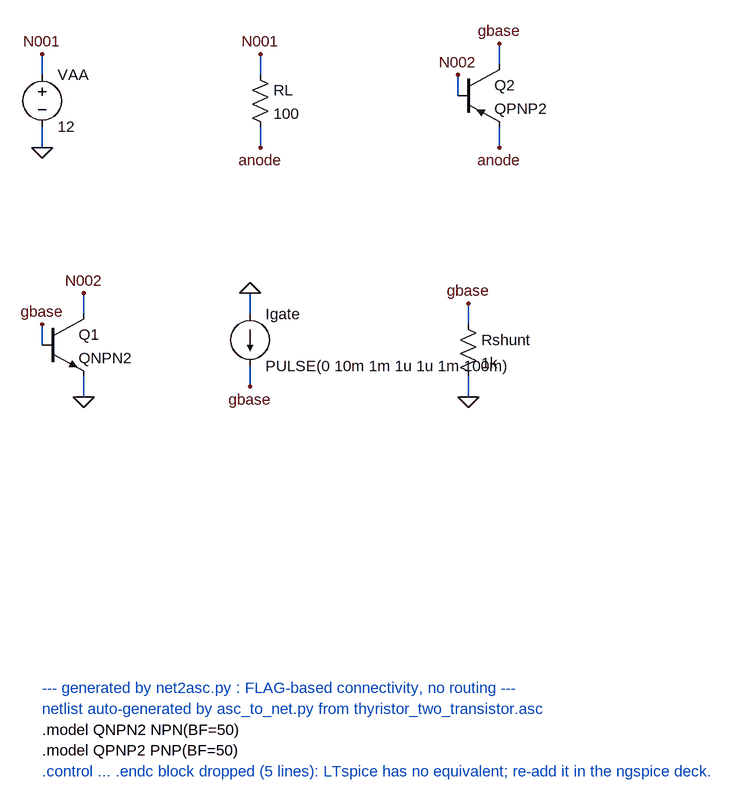
[diagram p0: schematic thyristor_two_transistor.asc]
thyristor_two_transistor.asc, the LTspice schematic file:
Version 4
SHEET 1 1104 1288
WIRE 0 16 0 -16
WIRE 0 96 0 128
WIRE 336 16 336 -16
WIRE 336 96 336 128
WIRE 704 0 704 -32
WIRE 640 48 640 16
WIRE 704 96 704 128
WIRE 64 384 64 352
WIRE 0 432 0 400
WIRE 64 480 64 512
WIRE 320 384 320 352
WIRE 320 464 320 496
WIRE 656 400 656 368
WIRE 656 480 656 512
FLAG 0 -16 N001
FLAG 0 128 0
FLAG 336 -16 N001
FLAG 336 128 anode
FLAG 704 -32 gbase
FLAG 640 16 N002
FLAG 704 128 anode
FLAG 64 352 N002
FLAG 0 400 gbase
FLAG 64 512 0
FLAG 320 352 0
FLAG 320 496 gbase
FLAG 656 368 gbase
FLAG 656 512 0
SYMBOL voltage 0 0 R0
SYMATTR InstName VAA
SYMATTR Value 12
SYMBOL res 320 0 R0
SYMATTR InstName RL
SYMATTR Value 100
SYMBOL pnp 640 0 R0
SYMATTR InstName Q2
SYMATTR Value QPNP2
SYMBOL npn 0 384 R0
SYMATTR InstName Q1
SYMATTR Value QNPN2
SYMBOL current 320 384 R0
SYMATTR InstName Igate
SYMATTR Value PULSE(0 10m 1m 1u 1u 1m 100m)
SYMBOL res 640 384 R0
SYMATTR InstName Rshunt
SYMATTR Value 1k
TEXT 0 960 Left 2 ;--- generated by net2asc.py : FLAG-based connectivity, no routing ---
TEXT 0 992 Left 2 ;netlist auto-generated by asc_to_net.py from thyristor_two_transistor.asc
TEXT 0 1024 Left 2 !.model QNPN2 NPN(BF=50)
TEXT 0 1056 Left 2 !.model QPNP2 PNP(BF=50)
TEXT 0 1088 Left 2 ;.control ... .endc block dropped (5 lines): LTspice has no equivalent; re-add it in the ngspice deck.

The netlist it stands for:
* thyristor_two_transistor.asc
VAA N001 0 12
RL N001 anode 100
Q2 gbase N002 anode 0 QPNP2
Q1 N002 gbase 0 0 QNPN2
Igate 0 gbase PULSE(0 10m 1m 1u 1u 1m 100m)
Rshunt gbase 0 1k
.model NPN NPN
.model PNP PNP
.lib standard.bjt
* --- generated by net2asc.py : FLAG-based connectivity, no routing ---
* netlist auto-generated by asc_to_net.py from thyristor_two_transistor.asc
.model QNPN2 NPN(BF=50)
.model QPNP2 PNP(BF=50)
* .control ... .endc block dropped (5 lines): LTspice has no equivalent; re-add it in the ngspice deck.
.backanno
.end